# Altium schematic sheet STM32_TOP.SchDoc
size A4
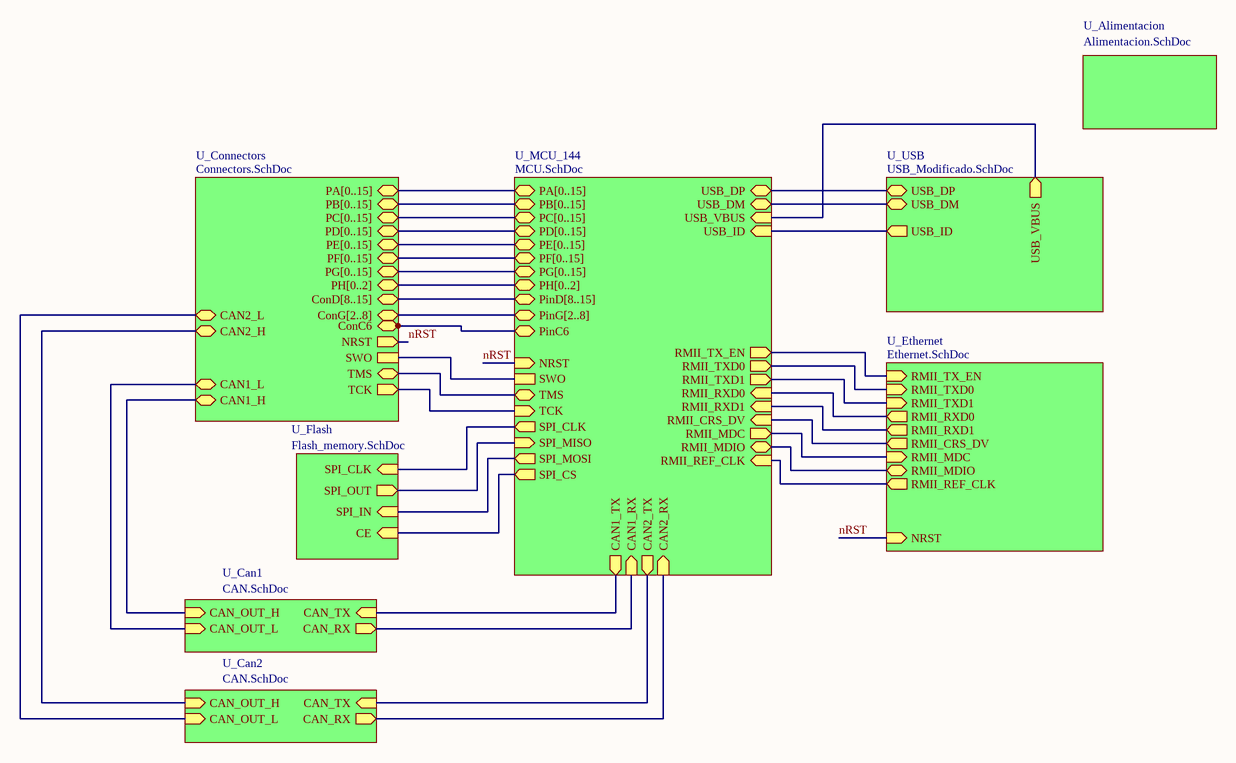
[diagram p0: STM32_TOP.SchDoc]

## Sub-sheets
U_Alimentacion = Alimentacion.SchDoc: no entries
U_Can1 = CAN.SchDoc: CAN_OUT_H (in), CAN_OUT_L (in), CAN_RX (out), CAN_TX (in)
U_Can2 = CAN.SchDoc: CAN_OUT_H (in), CAN_OUT_L (in), CAN_RX (out), CAN_TX (in)
U_Connectors = Connectors.SchDoc: PA[0..15] (bidir), PB[0..15] (bidir), PC[0..15] (bidir), PD[0..15] (bidir), PE[0..15] (bidir), PF[0..15] (bidir), PG[0..15] (bidir), PH[0..2] (bidir), CAN2_H (bidir), CAN2_L (bidir), CAN1_H (bidir), CAN1_L (bidir), ConD[8..15] (bidir), ConG[2..8] (bidir), TCK (out), TMS (bidir), SWO, NRST (out), ConC6 (bidir)
U_Ethernet = Ethernet.SchDoc: RMII_TXD0 (in), RMII_TX_EN (in), RMII_RXD0 (out), RMII_REF_CLK (out), RMII_CRS_DV (out), RMII_MDC (in), RMII_MDIO (bidir), NRST (in), RMII_TXD1 (in), RMII_RXD1 (out)
U_Flash = Flash_memory.SchDoc: SPI_CLK (in), SPI_OUT (out), SPI_IN (in), CE (in)
U_MCU_144 = MCU.SchDoc: PA[0..15] (bidir), PB[0..15] (bidir), PC[0..15] (bidir), PD[0..15] (bidir), PE[0..15] (bidir), PF[0..15] (bidir), PG[0..15] (bidir), PH[0..2] (bidir), USB_DM (bidir), USB_DP (bidir), USB_ID (in), USB_VBUS (in), RMII_TXD0 (out), RMII_TX_EN (out), RMII_RXD0 (in), RMII_REF_CLK (in), RMII_CRS_DV (in), RMII_MDC (out), RMII_MDIO (bidir), RMII_TXD1 (out), RMII_RXD1 (in), SPI_MISO (in), SPI_MOSI (out), SPI_CS (out), SPI_CLK (out), CAN1_TX (out), CAN1_RX (in), CAN2_TX (out), CAN2_RX (in), PinD[8..15] (bidir), PinG[2..8] (bidir), TCK (in), TMS (bidir), SWO, NRST (in), PinC6 (bidir)
U_USB = USB_Modificado.SchDoc: USB_DM (bidir), USB_DP (bidir), USB_ID (out), USB_VBUS (out)

## Nets
nRST: sheet U_MCU_144/NRST, sheet U_Ethernet/NRST, sheet U_Connectors/NRST
(unnamed): sheet U_MCU_144/USB_DM, sheet U_USB/USB_DM
(unnamed): sheet U_MCU_144/USB_DP, sheet U_USB/USB_DP
(unnamed): sheet U_MCU_144/USB_ID, sheet U_USB/USB_ID
(unnamed): sheet U_MCU_144/USB_VBUS, sheet U_USB/USB_VBUS
(unnamed): sheet U_MCU_144/RMII_TXD0, sheet U_Ethernet/RMII_TXD0
(unnamed): sheet U_MCU_144/RMII_TX_EN, sheet U_Ethernet/RMII_TX_EN
(unnamed): sheet U_MCU_144/RMII_RXD0, sheet U_Ethernet/RMII_RXD0
(unnamed): sheet U_MCU_144/RMII_REF_CLK, sheet U_Ethernet/RMII_REF_CLK
(unnamed): sheet U_MCU_144/RMII_CRS_DV, sheet U_Ethernet/RMII_CRS_DV
(unnamed): sheet U_MCU_144/RMII_MDC, sheet U_Ethernet/RMII_MDC
(unnamed): sheet U_MCU_144/RMII_MDIO, sheet U_Ethernet/RMII_MDIO
(unnamed): sheet U_MCU_144/RMII_TXD1, sheet U_Ethernet/RMII_TXD1
(unnamed): sheet U_MCU_144/RMII_RXD1, sheet U_Ethernet/RMII_RXD1
(unnamed): sheet U_MCU_144/SPI_MISO, sheet U_Flash/SPI_OUT
(unnamed): sheet U_MCU_144/SPI_MOSI, sheet U_Flash/SPI_IN
(unnamed): sheet U_MCU_144/SPI_CS, sheet U_Flash/CE
(unnamed): sheet U_MCU_144/SPI_CLK, sheet U_Flash/SPI_CLK
(unnamed): sheet U_MCU_144/CAN1_TX, sheet U_Can1/CAN_TX
(unnamed): sheet U_MCU_144/CAN1_RX, sheet U_Can1/CAN_RX
(unnamed): sheet U_MCU_144/CAN2_TX, sheet U_Can2/CAN_TX
(unnamed): sheet U_MCU_144/CAN2_RX, sheet U_Can2/CAN_RX
(unnamed): sheet U_MCU_144/TCK, sheet U_Connectors/TCK
(unnamed): sheet U_MCU_144/TMS, sheet U_Connectors/TMS
(unnamed): sheet U_MCU_144/SWO, sheet U_Connectors/SWO
(unnamed): sheet U_MCU_144/PinC6, sheet U_Connectors/ConC6
(unnamed): sheet U_Connectors/CAN2_H, sheet U_Can2/CAN_OUT_H
(unnamed): sheet U_Connectors/CAN2_L, sheet U_Can2/CAN_OUT_L
(unnamed): sheet U_Connectors/CAN1_H, sheet U_Can1/CAN_OUT_H
(unnamed): sheet U_Connectors/CAN1_L, sheet U_Can1/CAN_OUT_L

## Buses and harness runs
bus sheet U_Connectors/ConD[8..15] = sheet U_MCU_144/PinD[8..15]
bus sheet U_Connectors/ConG[2..8] = sheet U_MCU_144/PinG[2..8]
bus sheet U_Connectors/PA[0..15] = sheet U_MCU_144/PA[0..15]
bus sheet U_Connectors/PB[0..15] = sheet U_MCU_144/PB[0..15]
bus sheet U_Connectors/PC[0..15] = sheet U_MCU_144/PC[0..15]
bus sheet U_Connectors/PD[0..15] = sheet U_MCU_144/PD[0..15]
bus sheet U_Connectors/PE[0..15] = sheet U_MCU_144/PE[0..15]
bus sheet U_Connectors/PF[0..15] = sheet U_MCU_144/PF[0..15]
bus sheet U_Connectors/PG[0..15] = sheet U_MCU_144/PG[0..15]
bus sheet U_Connectors/PH[0..2] = sheet U_MCU_144/PH[0..2]